# Altium project Bottom_floor.PrjPcb
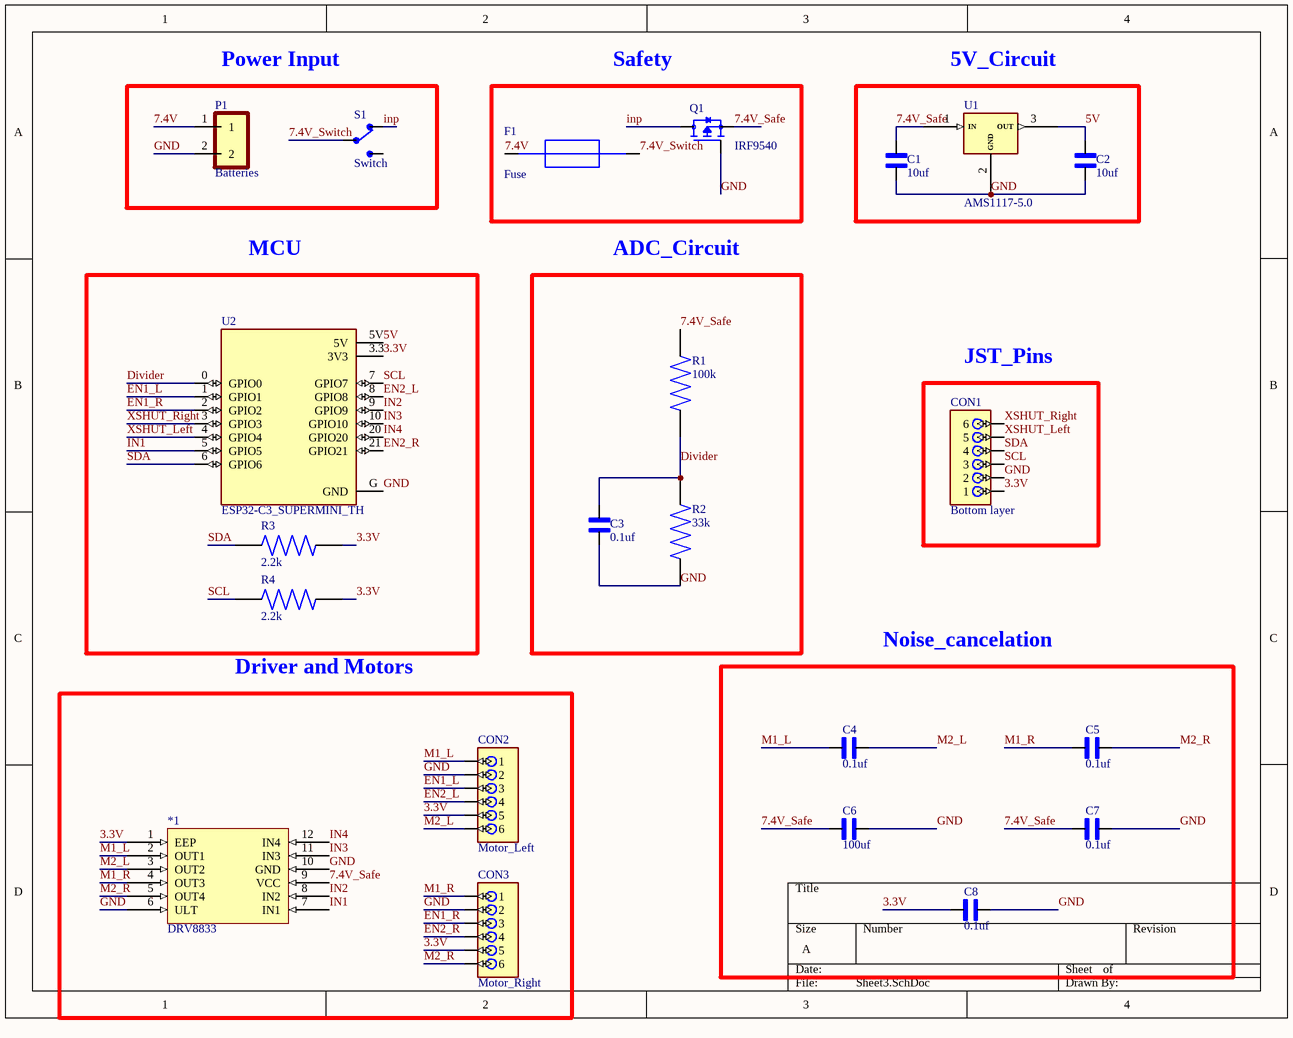
[diagram p0: Sheet3.SchDoc]
1 sheet, 22 parts. Net scope: global (net labels, ports and power ports of the same name join across sheets).
Board file: PCB3.PcbDoc

## Sheet Sheet3.SchDoc
size A; SheetNumber: 1; SheetTotal: 1

### Parts
*1  DRV8833  [MOD-DRV8833]
C1  10uf  [CAP_ECHU1H181GX5]
C2  10uf  [CAP_ECHU1H181GX5]
C3  0.1uf  [CAP_ECHU1H181GX5]
C4  0.1uf  [CAP_ECHU1H181GX5]
C5  0.1uf  [CAP_ECHU1H181GX5]
C6  100uf  [CAPC3225X280N]
C7  0.1uf  [CAPC3225X280N]
C8  0.1uf  [CAPC3225X280N]
CON1  Bottom layer  [6 pin JST]
CON2  Motor_Left  [6 pin JST]
CON3  Motor_Right  [6 pin JST]
F1  Fuse  [FUSC3216X75N]
P1  Batteries  [Green Terminal]
Q1  IRF9540  [TO254P1052X465X1989-3]
R1  100k  [SMD R]
R2  33k  [SMD R]
R3  2.2k  [SMD R]
R4  2.2k  [SMD R]
S1  Switch  [SW_1101M2S3CQE2]
U1  AMS1117-5.0  [5V Regulator]
U2  ESP32-C3_SUPERMINI_TH  [MODULE_ESP32-C3_SUPERMINI_TH]

### Blocks framed on the sheet
Power Input: P1 S1
Safety: F1 Q1
5V_Circuit: C1 C2 U1
MCU: R3 R4 U2
ADC_Circuit: C3 R1 R2
JST_Pins: CON1
Driver and Motors: *1 CON2 CON3
Noise_cancelation: C4-C8

### Nets
3.3V: *1.1(EEP) C8.1 CON1.1 CON2.5 CON3.5 R3.2 R4.2 U2.3.3(3V3)
5V: C2.2 U1.3(OUT) U2.5V
7.4V: F1.1 P1.1
7.4V_Safe: *1.9(VCC) C1.2 C6.1 C7.1 Q1.3(S) R1.1 U1.1(IN)
7.4V_Switch: F1.2 S1.2
Divider: C3.2 R1.2 R2.1 U2.0(GPIO0)
EN1_L: CON2.3 U2.1(GPIO1)
EN1_R: CON3.3 U2.2(GPIO2)
EN2_L: CON2.4 U2.8(GPIO8)
EN2_R: CON3.4 U2.21(GPIO21)
GND: *1.6(ULT) *1.10(GND) C1.1 C2.1 C3.1 C6.2 C7.2 C8.2 CON1.2 CON2.2 CON3.2 P1.2 Q1.1(G) R2.2 U1.2(GND) U2.G(GND)
IN1: *1.7(IN1) U2.5(GPIO5)
IN2: *1.8(IN2) U2.9(GPIO9)
IN3: *1.11(IN3) U2.10(GPIO10)
IN4: *1.12(IN4) U2.20(GPIO20)
inp: Q1.2(D) S1.1
M1_L: *1.2(OUT1) C4.2 CON2.1
M1_R: *1.4(OUT3) C5.2 CON3.1
M2_L: *1.3(OUT2) C4.1 CON2.6
M2_R: *1.5(OUT4) C5.1 CON3.6
SCL: CON1.3 R4.1 U2.7(GPIO7)
SDA: CON1.4 R3.1 U2.6(GPIO6)
XSHUT_Left: CON1.5 U2.4(GPIO4)
XSHUT_Right: CON1.6 U2.3(GPIO3)

Not connected (* = marked no-connect by the designer): S1 3

### Library data of the parts
C1-C5 = ECHU1H181GX5: Capacitor Pps Film, 180pf, 50v, 2%, 0805capacitor Pps Film, 180pf, 50v, 2%, 0805; MF: Panasonic; Digi-Key_Part_Number: PCF1287TR-ND; SnapEDA_Link: https://www.snapeda.com/parts/ECHU1H181GX5/Panasonic/view-part/?ref=snap; Check_prices: https://www.snapeda.com/parts/ECHU1H181GX5/Panasonic/view-part/?ref=eda; Package: 0805-2 Panasonic; Purchase-URL: https://pricing.snapeda.com/search/part/ECHU1H181GX5/?ref=eda; MP: ECHU1H181GX5; Value: *
C6-C8 = CL32A107MQVNNWE: 100 ÂµF Â±20% 6.3V Ceramic Capacitor X5R 1210 (3225 Metric); MF: Samsung; SnapEDA_Link: https://www.snapeda.com/parts/CL32A107MQVNNWE/Samsung/view-part/?ref=snap; Package: SMD-2 Samsung; Value: *; MP: CL32A107MQVNNWE; Check_prices: https://www.snapeda.com/parts/CL32A107MQVNNWE/Samsung/view-part/?ref=eda
CON1-CON3 = 6 pin JST: Connector Header Surface Mount 6 position 0.059 (1.50mm); MF: JST; MP: B6B-ZR; SnapEDA_Link: https://www.snapeda.com/parts/B6B-ZR/JST/view-part/?ref=snap; Package: None; Value: *; Check_prices: https://www.snapeda.com/parts/B6B-ZR/JST/view-part/?ref=eda
F1 = 1206L035YR: Polymeric PTC Resettable Fuse 6V 350 mA Ih Surface Mount 1206 (3216 Metric), Concave; MF: Littelfuse Inc.; SnapEDA_Link: https://www.snapeda.com/parts/1206L035YR/Littelfuse/view-part/?ref=snap; Package: 1206 Littelfuse; Value: *; MP: 1206L035YR; Check_prices: https://www.snapeda.com/parts/1206L035YR/Littelfuse/view-part/?ref=eda
P1 = Green Terminal: Ð Ð°Ð·ÑŠÐµÐ¼Ð½Ñ‹Ðµ ÐºÐ»ÐµÐ¼Ð¼Ð½Ñ‹Ðµ ÐºÐ¾Ð»Ð¾Ð´ÐºÐ¸ Ð Ð¾Ð·ÐµÑ‚ÐºÐ° 2 Ð¿Ð¾Ð»Ð¾Ð¶ÐµÐ½Ð¸Ñ 5,08 Ð¼Ð¼ ÐŸÑ€Ð¸Ð¿Ð¾Ð¹ Ð¿Ñ€ÑÐ¼Ð¾Ð¹ Ñ‡ÐµÑ€ÐµÐ· Ð¾Ñ‚Ð²ÐµÑ€ÑÑ‚Ð¸Ðµ 13,5 Ð / ÐºÐ¾Ð½Ñ‚Ð°ÐºÑ‚; MF: TE Connectivity; MP: 282837-2; SnapEDA_Link: https://www.snapeda.com/parts/282837-2/TE+Connectivity+AMP+Connectors/view-part/?ref=snap; Price: None; Check_prices: https://www.snapeda.com/parts/282837-2/TE+Connectivity+AMP+Connectors/view-part/?ref=eda; Purchase-URL: https://pricing.snapeda.com/search/part/282837-2/?ref=eda; Value: *; Availability: In Stock; Package: None
Q1 = IRF9540: P-Channel 100 V 19A (Tc) 3.7W (Ta), 150W (Tc) Surface Mount DÂ²PAK (TO-263); MF: Vishay; SnapEDA_Link: https://www.snapeda.com/parts/IRF9540/Vishay+Siliconix/view-part/?ref=snap; Package: TO-220-3 Vishay; Value: *; MP: IRF9540; Check_prices: https://www.snapeda.com/parts/IRF9540/Vishay+Siliconix/view-part/?ref=eda
R1-R4 = SMD R 0805: MP: ERJU06F91R0V; Availability: Unavailable; Price: None; Value: *; Package: None
S1 = 1101M2S3CQE2: Switch,Slide,Sealed,SPDT,ON-NONE-ON,PC Mnt,.200 Blk Act,6A,120VAC,PC Thru-Hole | C&K 1101M2S3CQE2; SnapEDA_Link: https://www.snapeda.com/parts/1101M2S3CQE2/C%2526K/view-part/?ref=snap; Package: None; Value: *; MF: C&K; MP: 1101M2S3CQE2; Check_prices: https://www.snapeda.com/parts/1101M2S3CQE2/C%2526K/view-part/?ref=eda
U1 = 5V Regulator
U2 = ESP32-C3_SUPERMINI_TH: Super tiny ESP32-C3 board; MF: Espressif Systems; MP: ESP32-C3 SuperMini_TH; SnapEDA_Link: https://www.snapeda.com/parts/ESP32-C3%20SuperMini_TH/Espressif+Systems/view-part/?ref=snap; Package: Package; Value: *; Check_prices: https://www.snapeda.com/parts/ESP32-C3%20SuperMini_TH/Espressif+Systems/view-part/?ref=eda